# Altium project AMS_Slave_Passiv_V2.PrjPcb
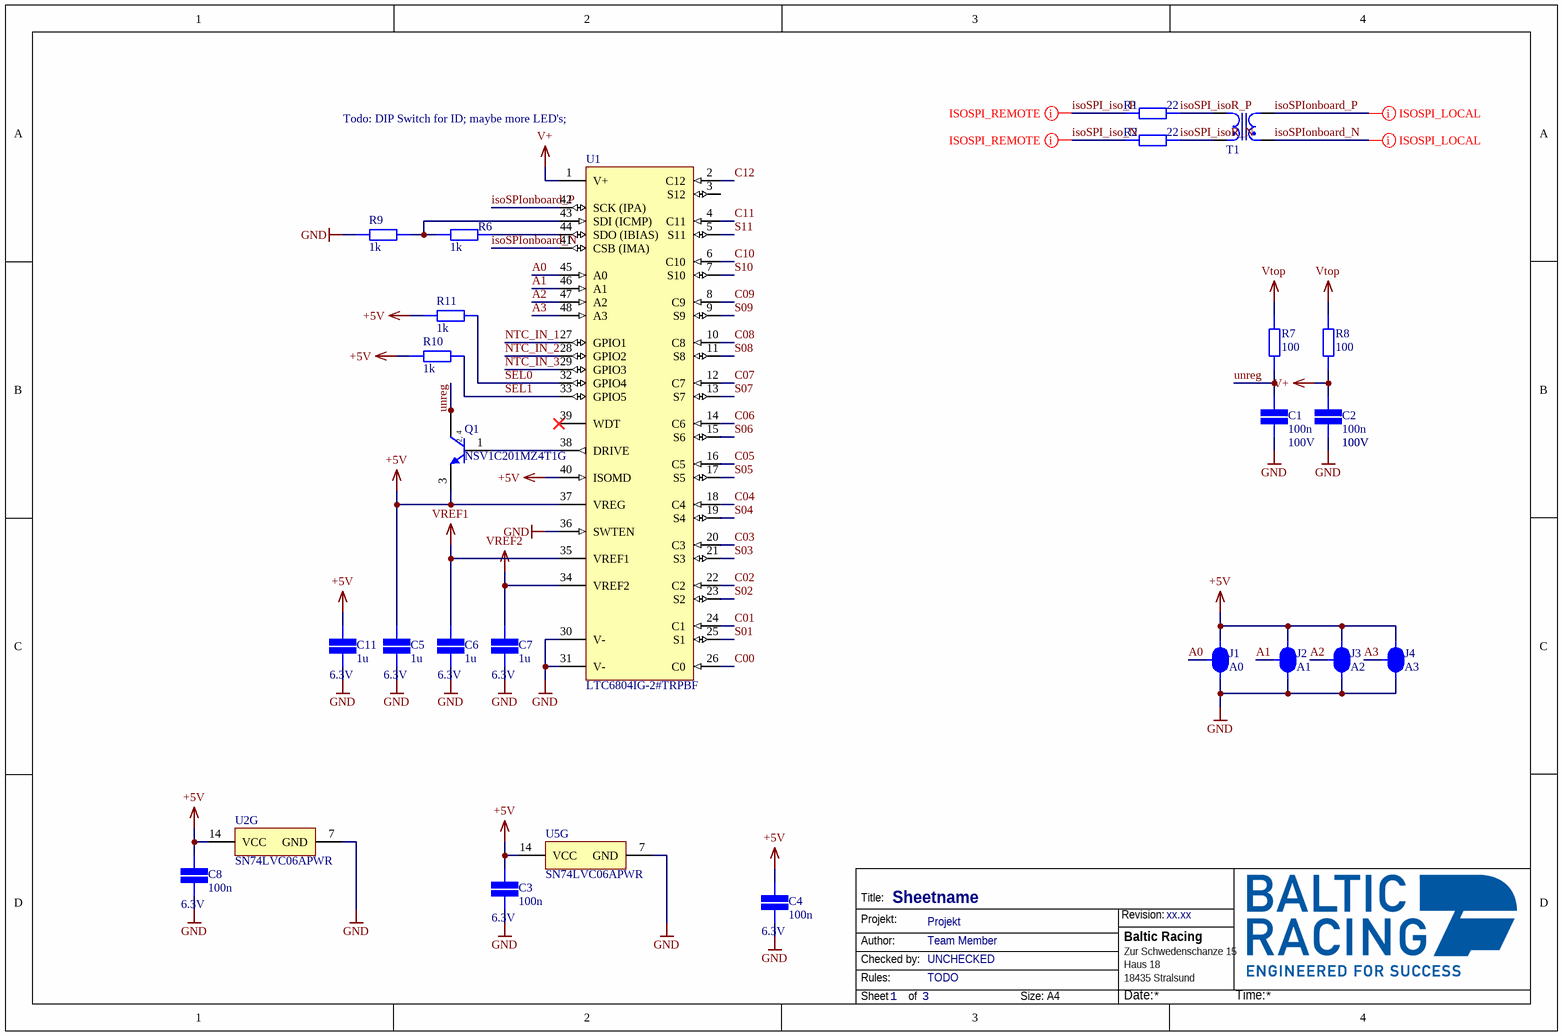
[diagram p0: AMS_Slave_Controller.SchDoc]
BoardName: ams-slave; BoardRevision: 1.0; Organization: Baltic Racing
3 sheets, 118 parts. Net scope: global (net labels, ports and power ports of the same name join across sheets).
Board file: AMS_Slave_Passiv_V2.PcbDoc
Sheets:
  AMS_Slave_Controller.SchDoc
  AMS_Slave_Balancing.SchDoc
  AMS_Slave_Measurement.SchDoc

## Sheet AMS_Slave_Controller.SchDoc: Sheetname
size A4; Date: 05.10.2017; CheckedBy: UNCHECKED; Author: Team Member; Organization: Baltic Racing; Address1: Zur Schwedenschanze 15; Address2: Haus 18; Address3: 18435 Stralsund; Revision: xx.xx; SheetNumber: 1; SheetTotal: 3; Rules: TODO; ProjectName: Projekt

### Parts
C1  value 100n  Voltage: 100V  [CAP 0805/2012]  (hidden comment: SMD Capacitor)
C2  value 100n  Voltage: 100V  [CAP 0805/2012]  (hidden comment: SMD Capacitor)
C3  value 100n  Voltage: 6.3V  [CAP 0603/1608]  (hidden comment: SMD Capacitor)
C4  value 100n  Voltage: 6.3V  [CAP 0603/1608]  (hidden comment: SMD Capacitor)
C5  value 1u  Voltage: 6.3V  [CAP 0805/2012]  (hidden comment: SMD Capacitor)
C6  value 1u  Voltage: 6.3V  [CAP 0805/2012]  (hidden comment: SMD Capacitor)
C7  value 1u  Voltage: 6.3V  [CAP 0805/2012]  (hidden comment: SMD Capacitor)
C8  value 100n  Voltage: 6.3V  [CAP 0603/1608]  (hidden comment: SMD Capacitor)
C11  value 1u  Voltage: 6.3V  [CAP 0805/2012]  (hidden comment: SMD Capacitor)
J1  A0  [SMD-JUMPER-3]
J2  A1  [SMD-JUMPER-3]
J3  A2  [SMD-JUMPER-3]
J4  A3  [SMD-JUMPER-3]
Q1  NSV1C201MZ4T1G  [ONSC-SOT-223-4-318E-04_V]
R1  value 22  [STACKPOLE CSR0603]  (hidden comment: SMD Resistor)
R2  value 22  [STACKPOLE CSR0603]  (hidden comment: SMD Resistor)
R6  value 1k  [STACKPOLE CSR0603]  (hidden comment: SMD Resistor)
R7  value 100  [STACKPOLE CSR0603]  (hidden comment: SMD Resistor)
R8  value 100  [STACKPOLE CSR0603]  (hidden comment: SMD Resistor)
R9  value 1k  [STACKPOLE CSR0603]  (hidden comment: SMD Resistor)
R10  value 1k  [STACKPOLE CSR0603]  (hidden comment: SMD Resistor)
R11  value 1k  [STACKPOLE CSR0603]  (hidden comment: SMD Resistor)
T1  750110055  [Wuerth_750110055]  (value not drawn)
U1  LTC6804IG-2#TRPBF  [LT-G-48_M]
U2  SN74LVC06APWR  [PW0014A_M]  (part G of 7)
U5  SN74LVC06APWR  [PW0014A_M]  (part G of 7)

### Nets
+5V: C3.2 C4.2 C5.1 C8.2 C11.1 J1.3 J2.3 J3.3 J4.3 Q1.3(E) R10.1 R11.1 U1.37(VREG) U1.40(ISOMD) U2.14(VCC) U5.14(VCC)
GND: C1.1 C2.1 C3.1 C4.1 C5.2 C6.2 C7.2 C8.1 C11.2 J1.1 J2.1 J3.1 J4.1 R9.2 U1.30(V-) U1.31(V-) U1.36(SWTEN) U2.7(GND) U5.7(GND)
V+: C2.2 R8.1 U1.1(V+)
VREF1: C6.1 U1.35(VREF1)
VREF2: C7.1 U1.34(VREF2)
Vtop: R7.2 R8.2  [project net Cell11+]
A0: J1.2 U1.45(A0)
A1: J2.2 U1.46(A1)
A2: J3.2 U1.47(A2)
A3: J4.2 U1.48(A3)
C00: U1.26(C0)
C01: U1.24(C1)
C02: U1.22(C2)
C03: U1.20(C3)
C04: U1.18(C4)
C05: U1.16(C5)
C06: U1.14(C6)
C07: U1.12(C7)
C08: U1.10(C8)
C09: U1.8(C9)
C10: U1.6(C10)
C11: U1.4(C11)
C12: U1.2(C12)
isoSPI_iso_N: R2.1
isoSPI_iso_P: R1.1
isoSPI_isoR_N: R2.2 T1.1
isoSPI_isoR_P: R1.2 T1.2
isoSPIonboard_N: T1.4 U1.41(CSB_(IMA))
isoSPIonboard_P: T1.3 U1.42(SCK_(IPA))
NTC_IN_1: U1.27(GPIO1)
NTC_IN_2: U1.28(GPIO2)
NTC_IN_3: U1.29(GPIO3)
S01: U1.25(S1)
S02: U1.23(S2)
S03: U1.21(S3)
S04: U1.19(S4)
S05: U1.17(S5)
S06: U1.15(S6)
S07: U1.13(S7)
S08: U1.11(S8)
S09: U1.9(S9)
S10: U1.7(S10)
S11: U1.5(S11)
SEL0: R11.2 U1.32(GPIO4)
SEL1: R10.2 U1.33(GPIO5)
unreg: C1.2 Q1.2(C) Q1.4(C) R7.1
NetQ1_1: Q1.1(B) U1.38(DRIVE)
NetR6_1: R6.1 U1.44(SDO_(IBIAS))
NetR6_2: R6.2 R9.1 U1.43(SDI_(ICMP))

Not connected (* = marked no-connect by the designer): U1 3(S12) 39(WDT)*

### Layout directives
differential pair: isoSPI_iso_N, isoSPI_iso_P, isoSPIonboard_N, isoSPIonboard_P

### Notes on the sheet
- Todo: DIP Switch for ID; maybe more LED's;
- (near C2) 100V
- Title:
- Projekt:
- Revision:
- Author:
- Rules:
- Checked by:
- Sheet
- of
- Size:
- A4
- Date:
- Time:
- (in symbol CMP-1048-00450-1) 2, 4

### Library data of the parts
C1-C8 C11 = SMD Capacitor: Capacitor with multiple Footprints
J1-J4 = SMD Jumper 3
Q1 = CMP-1048-00450-1: 100 V, 2 A, Low VCE(sat), NPN Transistor, 4-Pin SOT-223, Pb-Free, Tape and Reel; Manufacturer: On Semiconductor; IC Continuous (A): 2; Note1: 0; PackageReference: SOT-223-4-318E-04; Polarity: NPN; ComponentLink3URL: http://www.onsemi.com/pub_link/Collateral/318E-04.PDF; RoHS: TRUE; PackageDescription: 4-Pin Small Outline Transistor, Body 6.5 x 3.5 mm, Pitch 2.3 mm; DatasheetVersion: Rev. 4; Mounting Technology: Surface Mount; ComponentLink1Description: Manufacturer URL; ComponentLink1URL: http://www.onsemi.com/; PackageVersion: Rev. N, 08/2009; ComponentLink2Description: Datasheet; Packing: Tape and Reel; ComponentLink2URL: http://www.onsemi.cn/pub_link/Collateral/NSS1C201MZ4-D.PDF; ComponentLink3Description: Package Specification; PartNumber: NSV1C201MZ4T1G
R1 R2 R6-R11 = SMD Resistor: Resistor with multiple footprints
T1 = Wuerth_Transformer_750110055: Würth Toroid Transformer 1:1 70µH; Order Nr.: 750312504; Hersteller: Würth
U1 = CMP-0471-00243-1: Multicell Battery Monitor, 60 V Vin MAX, 48-pin SOP (G-48), -40 to 85 degC, Pb-Free, Tape and Reel; Manufacturer: Linear Technology; Vin Max(V): 60; Number of Cells: > 1000 V of stacked Li-Ion cells; Battery Chemistry: Li-Ion, Li-Polymer, NiMH; Type of Charger: Battery Stack Monitor; ComponentLink3Description: Package Specification; RoHS: TRUE; Packing: Tape and Reel; ComponentLink2URL: http://cds.linear.com/docs/en/datasheet/680412f.pdf; Mounting Technology: Surface Mount; PartNumber: LTC6804IG-2#TRPBF; PackageDescription: 48-Pin Plastic SSOP, Body 12.8 x 5.3 mm, Pitch 0.5 mm; PackageReference: G-48; ComponentLink1Description: Manufacturer URL; ComponentLink1URL: http://www.linear.com/; PackageVersion: Rev. Ã˜, 01/2011; ComponentLink3URL: http://cds.linear.com/docs/en/packaging/05081887_0_G48.pdf; ComponentLink2Description: Datasheet
U2 U5 = CMP-1615-01057-2: Hex Inverter Buffers/Drivers With Open-Drain Outputs, PW0014A, LARGE T&R; Manufacturer: Texas Instruments; Technology Family: LVC; Output Drive (IOL/IOH)(Max)(mA): -24/24; VCC(Min)(V): 1.65; Voltage(Nom)(V): 1.8,2.5,2.7,3.3; Schmitt Trigger: No; Rating: Catalog; F @ Nom Voltage(Max)(Mhz): 100; Bits(#): 6; Input Type: CMOS,TTL; ICC @ Nom Voltage(Max)(mA): 0.04; tpd @ Nom Voltage(Max)(ns): 5.6,3.1,3.9,3.7; Output Type: CMOS; VCC(Max)(V): 3.6; PackageReference: PW0014A; Operating Temperature Range(C): -40 to 125; DatasheetVersion: SCAS596N; Generic Part Number: SN74LVC06A; Code_JEDEC: MO-153

## Sheet AMS_Slave_Balancing.SchDoc: Sheetname
size A4; Date: 05.10.2017; CheckedBy: UNCHECKED; Author: Team Member; Organization: Baltic Racing; Address1: Zur Schwedenschanze 15; Address2: Haus 18; Address3: 18435 Stralsund; Revision: xx.xx; SheetNumber: 3; SheetTotal: 3; Rules: TODO; ProjectName: Projekt
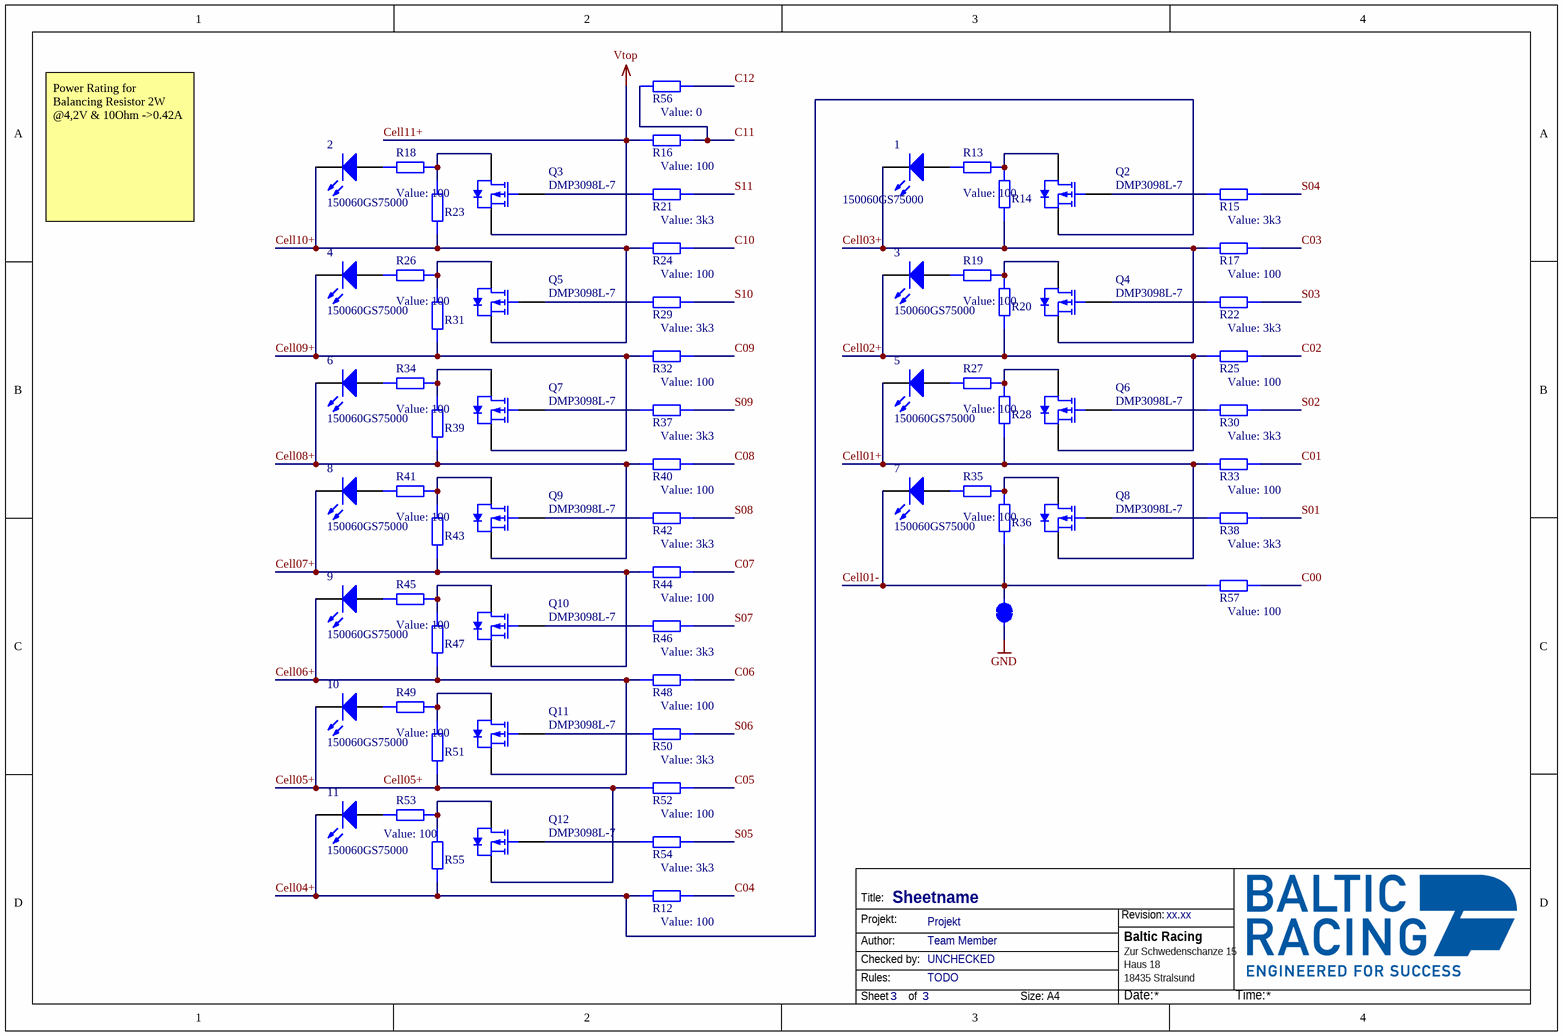
[diagram p1: AMS_Slave_Balancing.SchDoc]

### Parts
1  150060GS75000  [0603_A]
2  150060GS75000  [0603_A]
3  150060GS75000  [0603_A]
4  150060GS75000  [0603_A]
5  150060GS75000  [0603_A]
6  150060GS75000  [0603_A]
7  150060GS75000  [0603_A]
8  150060GS75000  [0603_A]
9  150060GS75000  [0603_A]
10  150060GS75000  [0603_A]
11  150060GS75000  [0603_A]
J5  SMD Jumper closed  [SMD-JUMPER-CLOSED]  (value not drawn)  (net tie, no BOM)
Q2  DMP3098L-7  [DIOD-SOT23-3_V]
Q3  DMP3098L-7  [DIOD-SOT23-3_V]
Q4  DMP3098L-7  [DIOD-SOT23-3_V]
Q5  DMP3098L-7  [DIOD-SOT23-3_V]
Q6  DMP3098L-7  [DIOD-SOT23-3_V]
Q7  DMP3098L-7  [DIOD-SOT23-3_V]
Q8  DMP3098L-7  [DIOD-SOT23-3_V]
Q9  DMP3098L-7  [DIOD-SOT23-3_V]
Q10  DMP3098L-7  [DIOD-SOT23-3_V]
Q11  DMP3098L-7  [DIOD-SOT23-3_V]
Q12  DMP3098L-7  [DIOD-SOT23-3_V]
R12  value 100  [STACKPOLE CSR0603]  (hidden comment: Value)
R13  value 100  [STACKPOLE CSR0603]  (hidden comment: SMD Resistor)
R14  SMD Resistor  [STACKPOLE CSRN2512]  (value not drawn)
R15  value 3k3  [STACKPOLE CSR0603]  (hidden comment: SMD Resistor)
R16  value 100  [STACKPOLE CSR0603]  (hidden comment: Value)
R17  value 100  [STACKPOLE CSR0603]  (hidden comment: Value)
R18  value 100  [STACKPOLE CSR0603]  (hidden comment: SMD Resistor)
R19  value 100  [STACKPOLE CSR0603]  (hidden comment: SMD Resistor)
R20  SMD Resistor  [STACKPOLE CSRN2512]  (value not drawn)
R21  value 3k3  [STACKPOLE CSR0603]  (hidden comment: SMD Resistor)
R22  value 3k3  [STACKPOLE CSR0603]  (hidden comment: SMD Resistor)
R23  SMD Resistor  [STACKPOLE CSRN2512]  (value not drawn)
R24  value 100  [STACKPOLE CSR0603]  (hidden comment: Value)
R25  value 100  [STACKPOLE CSR0603]  (hidden comment: Value)
R26  value 100  [STACKPOLE CSR0603]  (hidden comment: SMD Resistor)
R27  value 100  [STACKPOLE CSR0603]  (hidden comment: SMD Resistor)
R28  SMD Resistor  [STACKPOLE CSRN2512]  (value not drawn)
R29  value 3k3  [STACKPOLE CSR0603]  (hidden comment: SMD Resistor)
R30  value 3k3  [STACKPOLE CSR0603]  (hidden comment: SMD Resistor)
R31  SMD Resistor  [STACKPOLE CSRN2512]  (value not drawn)
R32  value 100  [STACKPOLE CSR0603]  (hidden comment: Value)
R33  value 100  [STACKPOLE CSR0603]  (hidden comment: Value)
R34  value 100  [STACKPOLE CSR0603]  (hidden comment: SMD Resistor)
R35  value 100  [STACKPOLE CSR0603]  (hidden comment: SMD Resistor)
R36  SMD Resistor  [STACKPOLE CSRN2512]  (value not drawn)
R37  value 3k3  [STACKPOLE CSR0603]  (hidden comment: SMD Resistor)
R38  value 3k3  [STACKPOLE CSR0603]  (hidden comment: SMD Resistor)
R39  SMD Resistor  [STACKPOLE CSRN2512]  (value not drawn)
R40  value 100  [STACKPOLE CSR0603]  (hidden comment: Value)
R41  value 100  [STACKPOLE CSR0603]  (hidden comment: SMD Resistor)
R42  value 3k3  [STACKPOLE CSR0603]  (hidden comment: SMD Resistor)
R43  SMD Resistor  [STACKPOLE CSRN2512]  (value not drawn)
R44  value 100  [STACKPOLE CSR0603]  (hidden comment: Value)
R45  value 100  [STACKPOLE CSR0603]  (hidden comment: SMD Resistor)
R46  value 3k3  [STACKPOLE CSR0603]  (hidden comment: SMD Resistor)
R47  SMD Resistor  [STACKPOLE CSRN2512]  (value not drawn)
R48  value 100  [STACKPOLE CSR0603]  (hidden comment: Value)
R49  value 100  [STACKPOLE CSR0603]  (hidden comment: SMD Resistor)
R50  value 3k3  [STACKPOLE CSR0603]  (hidden comment: SMD Resistor)
R51  SMD Resistor  [STACKPOLE CSRN2512]  (value not drawn)
R52  value 100  [STACKPOLE CSR0603]  (hidden comment: Value)
R53  value 100  [STACKPOLE CSR0603]  (hidden comment: SMD Resistor)
R54  value 3k3  [STACKPOLE CSR0603]  (hidden comment: SMD Resistor)
R55  SMD Resistor  [STACKPOLE CSRN2512]  (value not drawn)
R56  value 0  [STACKPOLE CSR0603]  (hidden comment: Value)
R57  value 100  [STACKPOLE CSR0603]  (hidden comment: Value)

### Nets
Cell11+: Q3.2(S) R16.1  [also labelled Vtop]
GND: J5.1
C00: R57.2
C01: R33.2
C02: R25.2
C03: R17.2
C04: R12.2
C05: R52.2
C06: R48.2
C07: R44.2
C08: R40.2
C09: R32.2
C10: R24.2
C11: R16.2 R56.1
C12: R56.2
Cell01+: 5.1(K) Q8.2(S) R28.1 R33.1
Cell01-: 7.1(K) J5.2 R36.1 R57.1
Cell02+: 3.1(K) Q6.2(S) R20.1 R25.1
Cell03+: 1.1(K) Q4.2(S) R14.1 R17.1
Cell04+: 11.1(K) Q2.2(S) R12.1 R55.1
Cell05+: 10.1(K) Q12.2(S) R51.1 R52.1
Cell06+: 9.1(K) Q11.2(S) R47.1 R48.1
Cell07+: 8.1(K) Q10.2(S) R43.1 R44.1
Cell08+: 6.1(K) Q9.2(S) R39.1 R40.1
Cell09+: 4.1(K) Q7.2(S) R31.1 R32.1
Cell10+: 2.1(K) Q5.2(S) R23.1 R24.1
S01: R38.2
S02: R30.2
S03: R22.2
S04: R15.2
S05: R54.2
S06: R50.2
S07: R46.2
S08: R42.2
S09: R37.2
S10: R29.2
S11: R21.2
Net1_2: 1.2(A) R13.2
Net2_2: 2.2(A) R18.2
Net3_2: 3.2(A) R19.2
Net4_2: 4.2(A) R26.2
Net5_2: 5.2(A) R27.2
Net6_2: 6.2(A) R34.2
Net7_2: 7.2(A) R35.2
Net8_2: 8.2(A) R41.2
Net9_2: 9.2(A) R45.2
Net10_2: 10.2(A) R49.2
Net11_2: 11.2(A) R53.2
NetQ2_1: Q2.1(G) R15.1
NetQ2_3: Q2.3(D) R13.1 R14.2
NetQ3_1: Q3.1(G) R21.1
NetQ3_3: Q3.3(D) R18.1 R23.2
NetQ4_1: Q4.1(G) R22.1
NetQ4_3: Q4.3(D) R19.1 R20.2
NetQ5_1: Q5.1(G) R29.1
NetQ5_3: Q5.3(D) R26.1 R31.2
NetQ6_1: Q6.1(G) R30.1
NetQ6_3: Q6.3(D) R27.1 R28.2
NetQ7_1: Q7.1(G) R37.1
NetQ7_3: Q7.3(D) R34.1 R39.2
NetQ8_1: Q8.1(G) R38.1
NetQ8_3: Q8.3(D) R35.1 R36.2
NetQ9_1: Q9.1(G) R42.1
NetQ9_3: Q9.3(D) R41.1 R43.2
NetQ10_1: Q10.1(G) R46.1
NetQ10_3: Q10.3(D) R45.1 R47.2
NetQ11_1: Q11.1(G) R50.1
NetQ11_3: Q11.3(D) R49.1 R51.2
NetQ12_1: Q12.1(G) R54.1
NetQ12_3: Q12.3(D) R53.1 R55.2

### Notes on the sheet
- Power Rating for Balancing Resistor 2W @4,2V & 10Ohm ->0.42A
- Title:
- Projekt:
- Revision:
- Author:
- Rules:
- Checked by:
- Sheet
- of
- Size:
- A4
- Date:
- Time:

### Library data of the parts
1-11 = CMP-1426-00002-1: SMD mono-color Chip LED, WL-SMCW, Green; Manufacturer: Wuerth Elektronik; ComponentLink1URL: http://www.we-online.com; ComponentLink2Description: Datasheet; Color: Green; ComponentLink2URL: http://katalog.we-online.com/led/datasheet/150060GS75000.pdf; PartNumber: 150060GS75000; PackageReference: 0603_A; ComponentLink1Description: Manufacturer URL
Q2-Q12 = CMP-0697-00001-2: P-Channel Enhancement Mode MOSFET, -30 V VDS, -55 to 155 degC, 3-Pin SOT23, RoHS, Tape and Reel; Manufacturer: Diodes Inc; PD (TA: 25 degC)=1.08 W; VGS: +/- 20 V; VDS: -30 V; IDS (TA: 25 degC)=-3.8 A; RDS(on) (Max.) (VGS: 4.5 V)=120 mOhm; VGS(th) (Max.): -2.1 V; ComponentLink3Description: Package Specification; ComponentLink3URL: http://www.diodes.com/datasheets/ap02002.pdf; PackageDescription: 3-Pin Small Outline Transistor, Body 1.3 x 2.9 mm, Pitch 0.95 mm; PackageReference: SOT23; PartNumber: DMP3098L-7; ComponentLink1Description: Manufacturer URL; ComponentLink2Description: Datasheet; ComponentLink2URL: http://www.diodes.com/datasheets/ds31447.pdf; ComponentLink1URL: http://www.diodes.com/; DatasheetVersion: Rev. 8 - 2; Mounting Technology: Surface Mount; RoHS: TRUE; Packing: Tape and Reel; PackageVersion: Rev. 75; Operating Temperature Range: -55 to 150 degC
R12 R13 R15-R19 R21 R22 R24-R27 R29 R30 R32-R35 R37 R38 R40-R42 R44-R46 R48-R50 R52-R54 R56 R57 = SMD Resistor: Resistor with multiple footprints
R14 R20 R23 R28 R31 R36 R39 R43 R47 R51 R55 = SMD Resistor: Resistor with multiple footprints; Value: 10

## Sheet AMS_Slave_Measurement.SchDoc
size A3; SheetNumber: 3; SheetTotal: 3
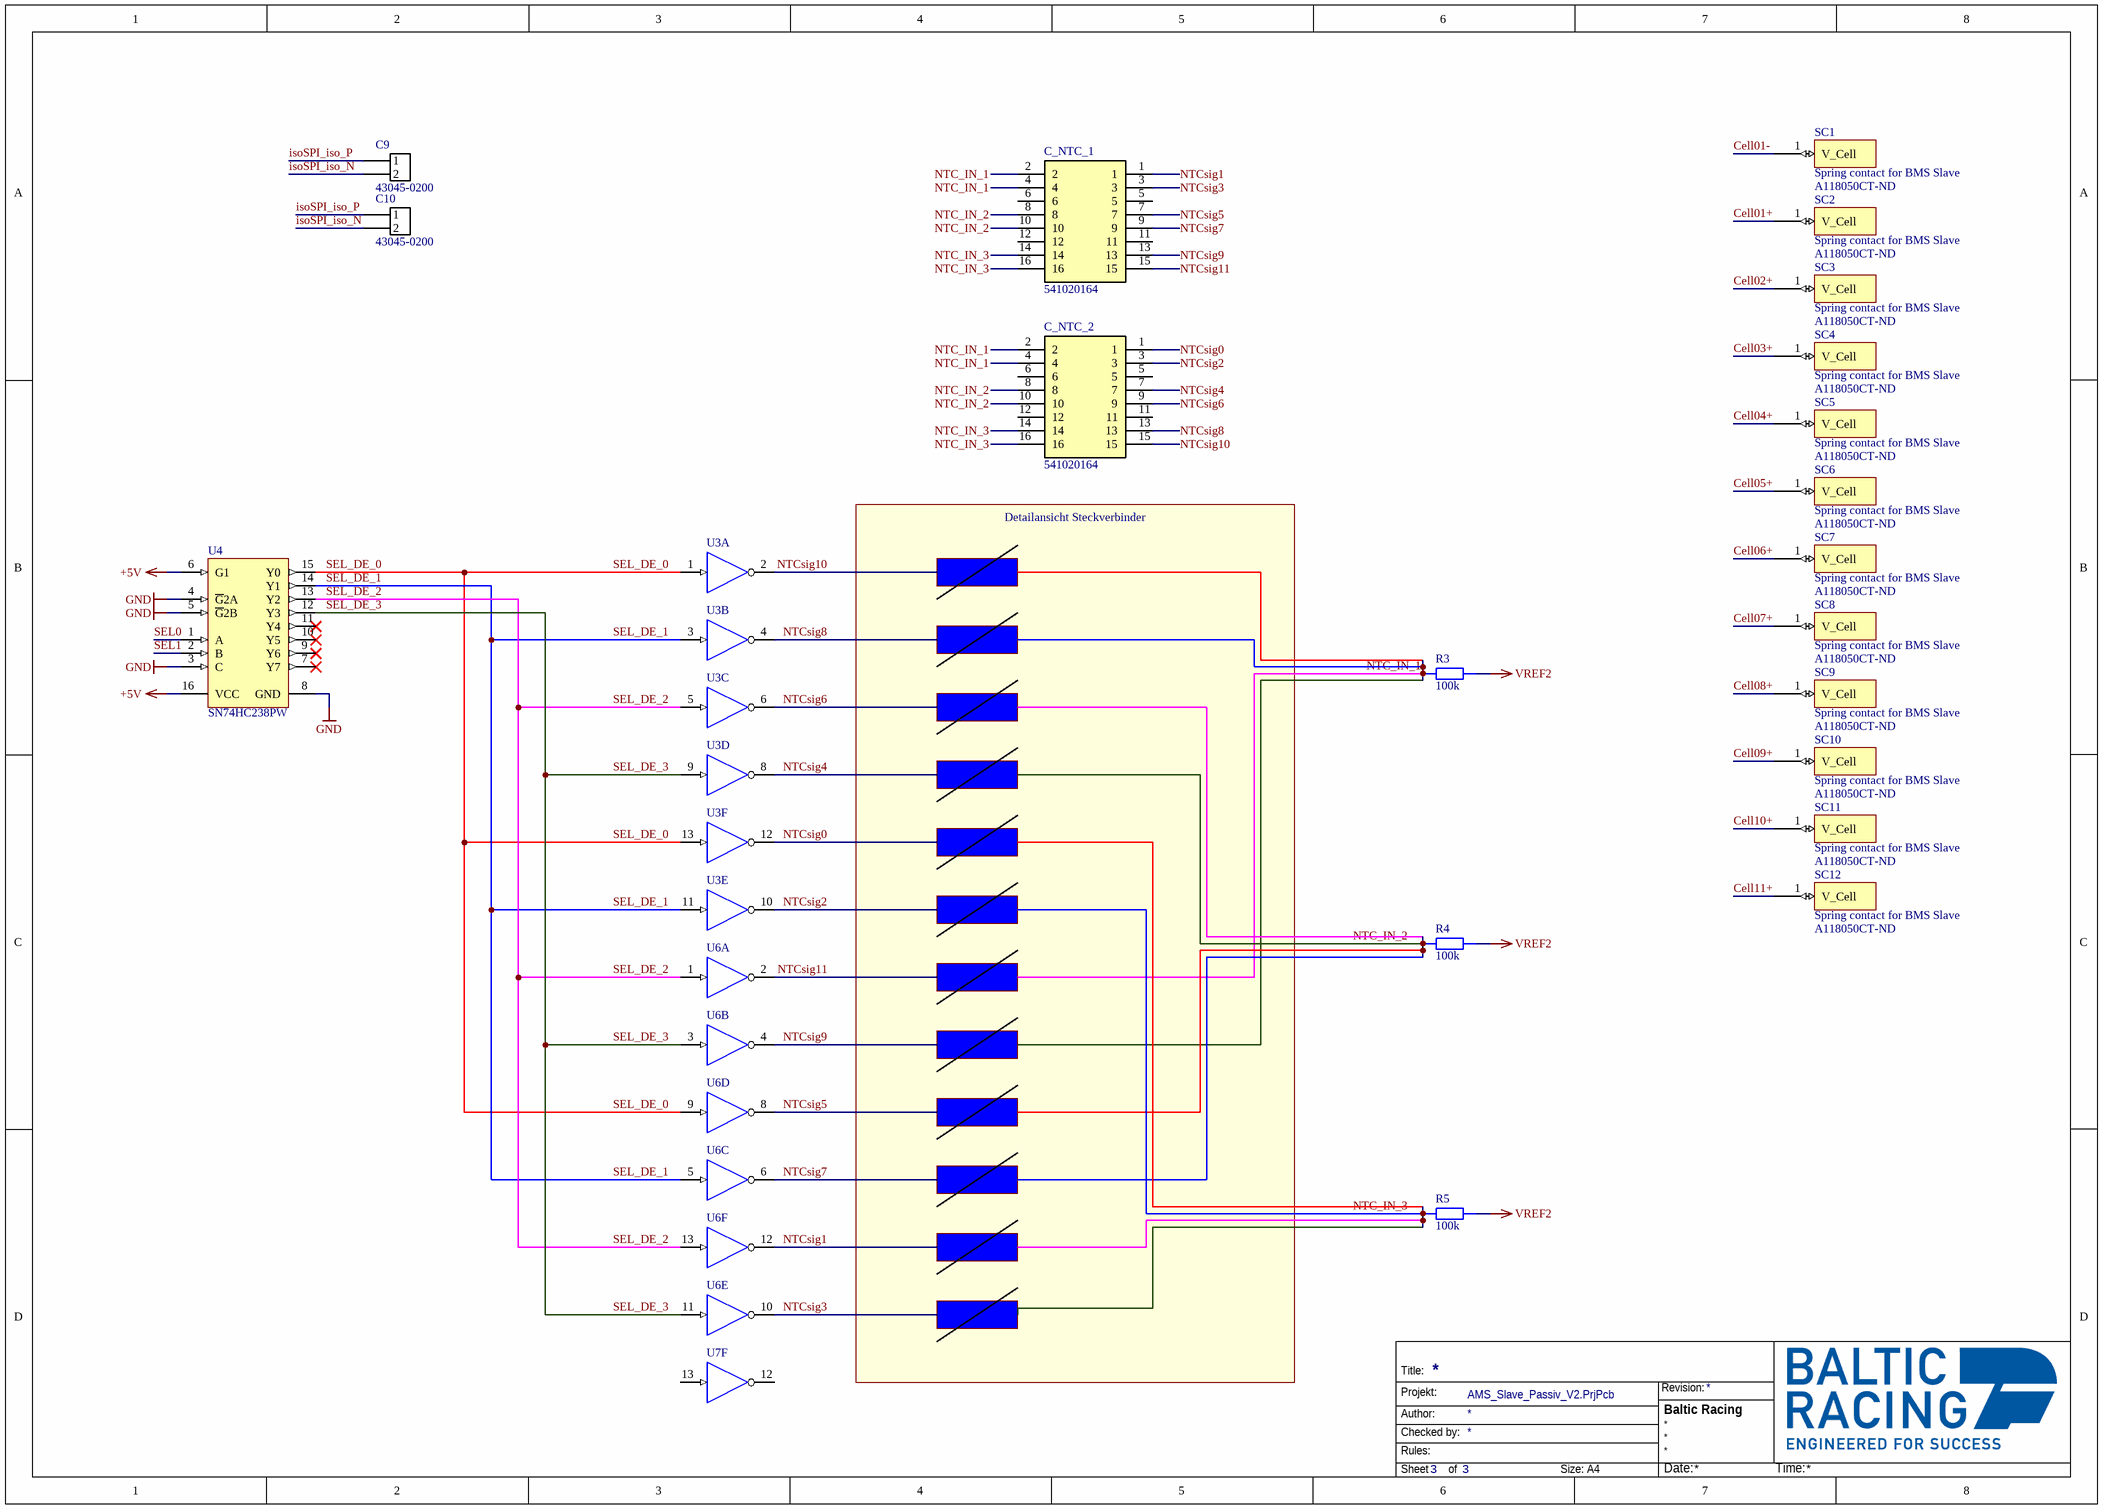
[diagram p2: AMS_Slave_Measurement.SchDoc]

### Parts
C9  43045-0200  [43650-0200]
C10  43045-0200  [43650-0200]
C_NTC_1  541020164  [541020164]
C_NTC_2  541020164  [541020164]
R3  value 100k  [STACKPOLE CSR0603]  (hidden comment: SMD Resistor)
R4  value 100k  [STACKPOLE CSR0603]  (hidden comment: SMD Resistor)
R5  value 100k  [STACKPOLE CSR0603]  (hidden comment: SMD Resistor)
SC1  Spring contact for BMS Slave  Supplier Part Number 1: A118050CT-ND  [1734300-1 Spring Contact]
SC2  Spring contact for BMS Slave  Supplier Part Number 1: A118050CT-ND  [1734300-1 Spring Contact]
SC3  Spring contact for BMS Slave  Supplier Part Number 1: A118050CT-ND  [1734300-1 Spring Contact]
SC4  Spring contact for BMS Slave  Supplier Part Number 1: A118050CT-ND  [1734300-1 Spring Contact]
SC5  Spring contact for BMS Slave  Supplier Part Number 1: A118050CT-ND  [1734300-1 Spring Contact]
SC6  Spring contact for BMS Slave  Supplier Part Number 1: A118050CT-ND  [1734300-1 Spring Contact]
SC7  Spring contact for BMS Slave  Supplier Part Number 1: A118050CT-ND  [1734300-1 Spring Contact]
SC8  Spring contact for BMS Slave  Supplier Part Number 1: A118050CT-ND  [1734300-1 Spring Contact]
SC9  Spring contact for BMS Slave  Supplier Part Number 1: A118050CT-ND  [1734300-1 Spring Contact]
SC10  Spring contact for BMS Slave  Supplier Part Number 1: A118050CT-ND  [1734300-1 Spring Contact]
SC11  Spring contact for BMS Slave  Supplier Part Number 1: A118050CT-ND  [1734300-1 Spring Contact]
SC12  Spring contact for BMS Slave  Supplier Part Number 1: A118050CT-ND  [1734300-1 Spring Contact]
U3  SN74LVC06APWR  [PW0014A_M]  (value not drawn)  (parts A,B,C,D,E,F of 7)
U4  SN74HC238PW  [SN74HC238PW Footprint]
U6  SN74LVC06APWR  [PW0014A_M]  (value not drawn)  (parts A,B,C,D,E,F of 7)
U7  SN74LVC06APWR  [PW0014A_M]  (value not drawn)  (part F of 7)

### Nets
+5V: U4.6(G1) U4.16(VCC)
Cell11+: SC12.1(V_Cell)
GND: U4.3(C) U4.4(~{G}2A) U4.5(~{G}2B) U4.8(GND)
VREF2: R3.2 R4.2 R5.2
Cell01+: SC2.1(V_Cell)
Cell01-: SC1.1(V_Cell)
Cell02+: SC3.1(V_Cell)
Cell03+: SC4.1(V_Cell)
Cell04+: SC5.1(V_Cell)
Cell05+: SC6.1(V_Cell)
Cell06+: SC7.1(V_Cell)
Cell07+: SC8.1(V_Cell)
Cell08+: SC9.1(V_Cell)
Cell09+: SC10.1(V_Cell)
Cell10+: SC11.1(V_Cell)
isoSPI_iso_N: C9.2 C10.2
isoSPI_iso_P: C9.1 C10.1
NTC_IN_1: C_NTC_1.2 C_NTC_1.4 C_NTC_2.2 C_NTC_2.4 R3.1
NTC_IN_2: C_NTC_1.8 C_NTC_1.10 C_NTC_2.8 C_NTC_2.10 R4.1
NTC_IN_3: C_NTC_1.14 C_NTC_1.16 C_NTC_2.14 C_NTC_2.16 R5.1
NTCsig0: C_NTC_2.1 U3.12(~{6Y})
NTCsig1: C_NTC_1.1 U6.12(~{6Y})
NTCsig2: C_NTC_2.3 U3.10(~{5Y})
NTCsig3: C_NTC_1.3 U6.10(~{5Y})
NTCsig4: C_NTC_2.7 U3.8(~{4Y})
NTCsig5: C_NTC_1.7 U6.8(~{4Y})
NTCsig6: C_NTC_2.9 U3.6(~{3Y})
NTCsig7: C_NTC_1.9 U6.6(~{3Y})
NTCsig8: C_NTC_2.13 U3.4(~{2Y})
NTCsig9: C_NTC_1.13 U6.4(~{2Y})
NTCsig10: C_NTC_2.15 U3.2(~{1Y})
NTCsig11: C_NTC_1.15 U6.2(~{1Y})
SEL0: U4.1(A)
SEL1: U4.2(B)
SEL_DE_0: U3.1(1A) U3.13(6A) U4.15(Y0) U6.9(4A)
SEL_DE_1: U3.3(2A) U3.11(5A) U4.14(Y1) U6.5(3A)
SEL_DE_2: U3.5(3A) U4.13(Y2) U6.1(1A) U6.13(6A)
SEL_DE_3: U3.9(4A) U4.12(Y3) U6.3(2A) U6.11(5A)

Not connected (* = marked no-connect by the designer): C_NTC_1 5 6 11 12; C_NTC_2 5 6 11 12; U4 7(Y7)* 9(Y6)* 10(Y5)* 11(Y4)*; U7 12(~{6Y}) 13(6A)

### Notes on the sheet
- Detailansicht Steckverbinder
- Title:
- Projekt:
- Revision:
- Author:
- Rules:
- Checked by:
- Sheet
- of
- Size:
- A4
- Date:
- Time:

### Library data of the parts
C9 C10 = MicroFit3.0 2-Pin: Molex Micro-Fit 3.0 2-Pin / 600V / 8.5A
C_NTC_1 C_NTC_2 = 541020164: 0.50mm Pitch SlimStack Receptacle, Surface Mount, Dual Row, Vertical, 2.50mm Stacking Height, Gold Plating with Nickel Barrier, 16 Circuits
R3-R5 = SMD Resistor: Resistor with multiple footprints
SC1-SC12 = 1734300-1: PCB Spring Contact, C-Clip, Uncompressed Height 3 mm [.118 in], Length 4.5 mm [.177 in], Width .098 in [2.5 mm]; Supplier 1: Digi-Key
U3 U6 U7 = CMP-1615-01057-2: as U2 on sheet AMS_Slave_Controller; PackageReference: PW0014A; Operating Temperature Range(C): -40 to 125; DatasheetVersion: SCAS596N; Generic Part Number: SN74LVC06A; Code_JEDEC: MO-153

## Nets that join several sheets
+5V: AMS_Slave_Controller (16 pins), AMS_Slave_Measurement (U4.6 U4.16)
Cell11+: AMS_Slave_Controller (R7.2 R8.2), AMS_Slave_Balancing (Q3.2 R16.1), AMS_Slave_Measurement (SC12.1)
GND: AMS_Slave_Controller (19 pins), AMS_Slave_Balancing (J5.1), AMS_Slave_Measurement (U4.3 U4.4 U4.5 U4.8)
VREF2: AMS_Slave_Controller (C7.1 U1.34), AMS_Slave_Measurement (R3.2 R4.2 R5.2)
C00: AMS_Slave_Controller (U1.26), AMS_Slave_Balancing (R57.2)
C01: AMS_Slave_Controller (U1.24), AMS_Slave_Balancing (R33.2)
C02: AMS_Slave_Controller (U1.22), AMS_Slave_Balancing (R25.2)
C03: AMS_Slave_Controller (U1.20), AMS_Slave_Balancing (R17.2)
C04: AMS_Slave_Controller (U1.18), AMS_Slave_Balancing (R12.2)
C05: AMS_Slave_Controller (U1.16), AMS_Slave_Balancing (R52.2)
C06: AMS_Slave_Controller (U1.14), AMS_Slave_Balancing (R48.2)
C07: AMS_Slave_Controller (U1.12), AMS_Slave_Balancing (R44.2)
C08: AMS_Slave_Controller (U1.10), AMS_Slave_Balancing (R40.2)
C09: AMS_Slave_Controller (U1.8), AMS_Slave_Balancing (R32.2)
C10: AMS_Slave_Controller (U1.6), AMS_Slave_Balancing (R24.2)
C11: AMS_Slave_Controller (U1.4), AMS_Slave_Balancing (R16.2 R56.1)
C12: AMS_Slave_Controller (U1.2), AMS_Slave_Balancing (R56.2)
Cell01+: AMS_Slave_Balancing (5.1 Q8.2 R28.1 R33.1), AMS_Slave_Measurement (SC2.1)
Cell01-: AMS_Slave_Balancing (7.1 J5.2 R36.1 R57.1), AMS_Slave_Measurement (SC1.1)
Cell02+: AMS_Slave_Balancing (3.1 Q6.2 R20.1 R25.1), AMS_Slave_Measurement (SC3.1)
Cell03+: AMS_Slave_Balancing (1.1 Q4.2 R14.1 R17.1), AMS_Slave_Measurement (SC4.1)
Cell04+: AMS_Slave_Balancing (11.1 Q2.2 R12.1 R55.1), AMS_Slave_Measurement (SC5.1)
Cell05+: AMS_Slave_Balancing (10.1 Q12.2 R51.1 R52.1), AMS_Slave_Measurement (SC6.1)
Cell06+: AMS_Slave_Balancing (9.1 Q11.2 R47.1 R48.1), AMS_Slave_Measurement (SC7.1)
Cell07+: AMS_Slave_Balancing (8.1 Q10.2 R43.1 R44.1), AMS_Slave_Measurement (SC8.1)
Cell08+: AMS_Slave_Balancing (6.1 Q9.2 R39.1 R40.1), AMS_Slave_Measurement (SC9.1)
Cell09+: AMS_Slave_Balancing (4.1 Q7.2 R31.1 R32.1), AMS_Slave_Measurement (SC10.1)
Cell10+: AMS_Slave_Balancing (2.1 Q5.2 R23.1 R24.1), AMS_Slave_Measurement (SC11.1)
isoSPI_iso_N: AMS_Slave_Controller (R2.1), AMS_Slave_Measurement (C9.2 C10.2)
isoSPI_iso_P: AMS_Slave_Controller (R1.1), AMS_Slave_Measurement (C9.1 C10.1)
NTC_IN_1: AMS_Slave_Controller (U1.27), AMS_Slave_Measurement (5 pins)
NTC_IN_2: AMS_Slave_Controller (U1.28), AMS_Slave_Measurement (5 pins)
NTC_IN_3: AMS_Slave_Controller (U1.29), AMS_Slave_Measurement (5 pins)
S01: AMS_Slave_Controller (U1.25), AMS_Slave_Balancing (R38.2)
S02: AMS_Slave_Controller (U1.23), AMS_Slave_Balancing (R30.2)
S03: AMS_Slave_Controller (U1.21), AMS_Slave_Balancing (R22.2)
S04: AMS_Slave_Controller (U1.19), AMS_Slave_Balancing (R15.2)
S05: AMS_Slave_Controller (U1.17), AMS_Slave_Balancing (R54.2)
S06: AMS_Slave_Controller (U1.15), AMS_Slave_Balancing (R50.2)
S07: AMS_Slave_Controller (U1.13), AMS_Slave_Balancing (R46.2)
S08: AMS_Slave_Controller (U1.11), AMS_Slave_Balancing (R42.2)
S09: AMS_Slave_Controller (U1.9), AMS_Slave_Balancing (R37.2)
S10: AMS_Slave_Controller (U1.7), AMS_Slave_Balancing (R29.2)
S11: AMS_Slave_Controller (U1.5), AMS_Slave_Balancing (R21.2)
SEL0: AMS_Slave_Controller (R11.2 U1.32), AMS_Slave_Measurement (U4.1)
SEL1: AMS_Slave_Controller (R10.2 U1.33), AMS_Slave_Measurement (U4.2)